# Altium schematic sheet Instrument.SchDoc: PCB-Tester Instrument
size A4; Date: JUN 2020; CheckedBy: Moerz, Hoeren; Author: Rudziński; CompanyName: TDK-Micronas GmbH; DrawnBy: Rudziński; Engineer: Rudziński; Organization: Test Engineering; Address1: Hans-Bunte-Strasse 19; Address2: D-79108 Freiburg; Address3: Germany; DocumentNumber: U33110; Revision: V1.0; SheetNumber: 13; SheetTotal: 20; DateDraw: JUN 2020; DateChecked: 2020-06-19; Workspace: Workspace; TitleTyp: Title-Typ; PageSetup: Record=PageOptions|CenterHorizontal=True|CenterVertical=True|PrintScale=0.97|XCorrection=1.00|YCorrection=1.00|PrintKind=0|BorderSize=5000000|LeftOffset=0|BottomOffset=0|Orientation=2|PaperLength=1000|PaperWidth=1000|Scale=100|PaperSource=7|PrintQuality=-3|MediaType=1|DitherType=10|PrintScaleMode=1|PaperKind=A4|PaperIndex=9
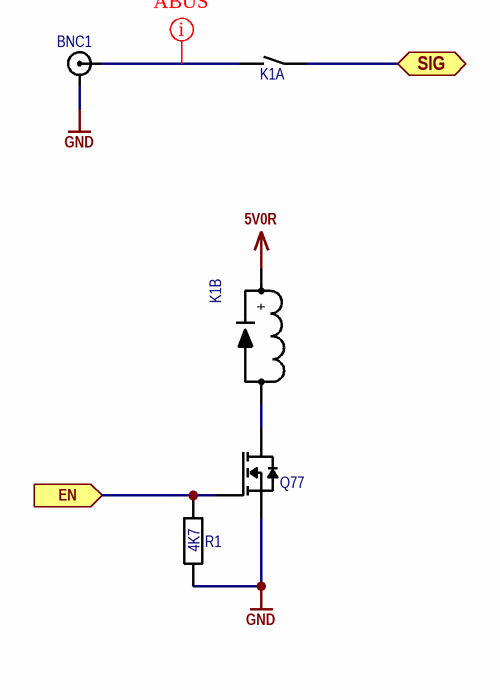
[diagram p0: Instrument.SchDoc]

## Parts
BNC1  X  [BNC]  (value not drawn)
K1  K  [118-1A]  (value not drawn)  (parts A,B of 2)
Q77  Q  [SOT23-3]  (value not drawn)
R1  value 4K7  [R0603 Reflow]  (hidden comment: R)

## Ports
EN (in), SIG (bidir)

## Nets
5V0R: K1.1(+)
GND: BNC1.0 Q77.2(S) R1.1
EN: Q77.1(G) R1.2 ; port EN
SIG: K1.4(CB) ; port SIG
NetBNC1_1: BNC1.1 K1.3(CA)
NetK1_2: K1.2(-) Q77.3(D)

## Layout directives
net class ABUS: NetBNC1_1

## Notes on the sheet
- designed by
- reviewed by
- last drawn by
- Project:
- Schematic:
- last printed
- DIN-A4 L
- sheets
- of
- File:

## Library data of the parts
BNC1 = BNC: BNC Connector; 04. Manufacturer: Amphenol RF; 07. Manufacturer  Part Number: 112778; 03. Unit Price: 11.91; 13. Created Date/Name: AUG 2018 / Hören; ComponentLink1Description: Info; 02. Distributor Part Number: ACX1985-ND; 01. Distributor: DigiKey; ComponentLink2Description: DataSheet; ComponentLink3Description: FootPrint; System: Connector
K1 = 118-1-A-5/2D: 5V Signal Relais, Normal Open; 04. Manufacturer: Pickering; 03. Unit Price: 2.60; 05. Quantity: 1000; 06. Data Sheet: Pickering_series_118.pdf; 13. Created Date/Name: 20.12.17 S. Kaiser; Coil Resistance: 1500 Ohm; Max Carry Current: 1.2 A; Max Switch Current: 1A; Max Switch Voltage: 200V; Power Rating: 15W; 01. Distributor: Pickering; 02. Distributor Part Number: 118-1-A-5/2D; 07. Manufacturer  Part Number: 118-1-A-5/2D; 09. Operating Temperature: -20°C ~ +85°C; 11. RoHS: 2011/65/EU; ComponentLink1Description: Info; ComponentLink1URL: http://www.pickeringrelay.com/; ComponentLink2Description: DataSheet; ComponentLink2URL: https://www.pickeringrelay.com/products/single-line-sil-series-111-119/single-line-sil-series-118/; Coil Voltage: 5V
Q77 = FDV303N: MOSFET N-CH 25V 680MA SOT-23; 04. Manufacturer: ON Semiconductor; 03. Unit Price: 0.41; 13. Created Date/Name: AUG 2018 / Hören; Rds On: 450 mΩ @ id=500mA & Vgs=4.5V; Vgs,th: 1.5V @ 250uA; Power Rating: 350mW; 3D-Export: No; 01. Distributor: DigiKey; 02. Distributor Part Number: FDV303NDKR-ND; 07. Manufacturer  Part Number: FDV303N; 09. Operating Temperature: -55°C ~ 150°C (TJ); 11. RoHS: YES; ComponentLink1Description: Info; ComponentLink1URL: https://www.digikey.de/product-detail/en/on-semiconductor/FDV303N/FDV303NDKR-ND/1630434; ComponentLink2Description: DataSheet; ComponentLink2URL: https://media.digikey.com/pdf/Data%20Sheets/Fairchild%20PDFs/FDV303N.pdf; Vdss: 25V; Id: 680mA
R1 = R: RES SMD 4.7K OHM 1% 1/10W 0603; 04. Manufacturer: Yageo; 07. Manufacturer  Part Number: RC0603FR-074K7L; 03. Unit Price: 0.09; 13. Created Date/Name: AUG2018/Hören; Tolerance: ±1%; ComponentLink1URL: *; ComponentLink1Description: Info; 02. Distributor Part Number: 311-4.70KHRCT-ND; 09. Operating Temperature: -xx..+yy°C; 11. RoHS: ???; 01. Distributor: DigiKey; ComponentLink2Description: DataSheet; Package: *